# Altium schematic sheet AmpBreakout.SchDoc
size 431 x 279 mm; SheetNumber: 3; SheetTotal: 3
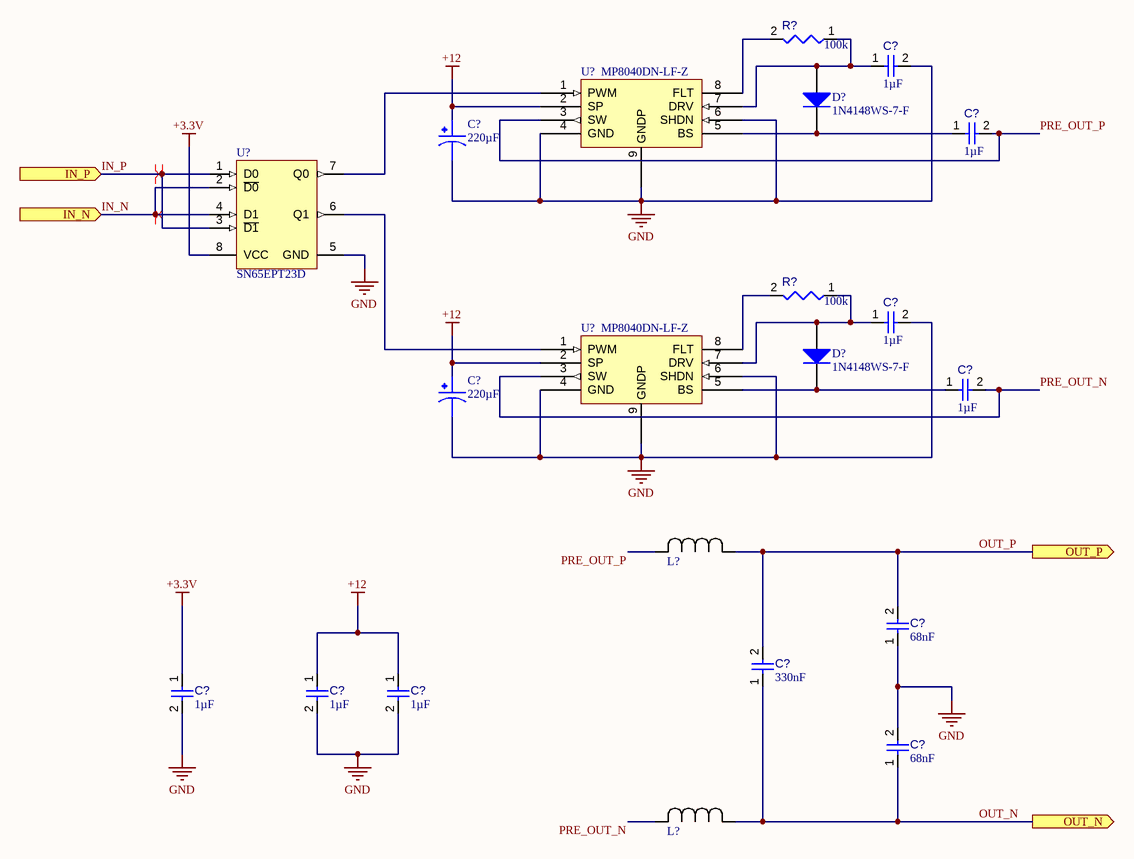
[diagram p0: AmpBreakout.SchDoc]

## Parts
(Parts that share a designator on the sheet are numbered #1, #2 ... from top to bottom, then left to right.)
C?#1  value 1µF  [CAPC2013X135X45NL10T25]  (hidden comment: Capacitor 1 uF +/- 10% 50 V 0805)
C?#2  value 1µF  [CAPC2013X135X45NL10T25]  (hidden comment: Capacitor 1 uF +/- 10% 50 V 0805)
C?#3  220µF  [CAPAE1030X1080N_UWT1H221MNL1GS]
C?#4  value 1µF  [CAPC2013X135X45NL10T25]  (hidden comment: Capacitor 1 uF +/- 10% 50 V 0805)
C?#5  value 1µF  [CAPC2013X135X45NL10T25]  (hidden comment: Capacitor 1 uF +/- 10% 50 V 0805)
C?#6  220µF  [CAPAE1030X1080N_UWT1H221MNL1GS]
C?#7  value 68nF  [FP-C0805C-DN-IPC_A]  (hidden comment: C0805C683K1RACTU)
C?#8  value 1µF  [CAPC2013X135X45NL10T25]  (hidden comment: Capacitor 1 uF +/- 10% 50 V 0805)
C?#9  value 1µF  [CAPC2013X135X45NL10T25]  (hidden comment: Capacitor 1 uF +/- 10% 50 V 0805)
C?#10  value 1µF  [CAPC2013X135X45NL10T25]  (hidden comment: Capacitor 1 uF +/- 10% 50 V 0805)
C?#11  value 330nF  [CAPC2012X14M]  (hidden comment: C2012X7R1H334K125AA)
C?#12  value 68nF  [FP-C0805C-DN-IPC_A]  (hidden comment: C0805C683K1RACTU)
D?#1  1N4148WS-7-F  [DIOD-SOD323-2-A_V]
D?#2  1N4148WS-7-F  [DIOD-SOD323-2-A_V]
L?#1  PQ2614BHA-220K  [IND_PQ2614_BRN]  (value not drawn)
L?#2  PQ2614BHA-220K  [IND_PQ2614_BRN]  (value not drawn)
R?#1  value 100k  [RESC0402(1005)_L]  (hidden comment: 100KR2F)
R?#2  value 100k  [RESC0402(1005)_L]  (hidden comment: 100KR2F)
U?#1  MP8040DN-LF-Z  [SOIC127P600X130_HS-9M]
U?#2  SN65EPT23D  [D0008A_L]
U?#3  MP8040DN-LF-Z  [SOIC127P600X130_HS-9M]

## Ports
IN_N (in), IN_P (in), OUT_N (out), OUT_P (out)

## Nets
+3.3V: C?#8.1 U?#2.8(VCC)
+12: C?#3.1 C?#6.1 C?#9.1 C?#10.1 U?#1.2(SP) U?#3.2(SP)
GND: C?#1.2 C?#3.2 C?#4.2 C?#6.2 C?#7.1 C?#8.2 C?#9.2 C?#10.2 C?#12.2 U?#1.4(GND) U?#1.6(SHDN) U?#1.9(GNDP) U?#2.5(GND) U?#3.4(GND) U?#3.6(SHDN) U?#3.9(GNDP)
IN_N: U?#2.2(~{D0}) U?#2.4(D1) ; port IN_N
IN_P: U?#2.1(D0) U?#2.3(~{D1}) ; port IN_P
OUT_N: C?#11.1 C?#12.1 L?#2.1 ; port OUT_N
OUT_P: C?#7.2 C?#11.2 L?#1.1 ; port OUT_P
PRE_OUT_N: C?#5.2 L?#2.2 U?#3.3(SW)
PRE_OUT_P: C?#2.2 L?#1.2 U?#1.3(SW)
NetC?#1_1: C?#1.1 D?#1.1(A) R?#1.1 U?#1.7(DRV)
NetC?#2_1: C?#2.1 D?#1.2(K) U?#1.5(BS)
NetC?#4_1: C?#4.1 D?#2.1(A) R?#2.1 U?#3.7(DRV)
NetC?#5_1: C?#5.1 D?#2.2(K) U?#3.5(BS)
NetR?#1_2: R?#1.2 U?#1.8(FLT)
NetR?#2_2: R?#2.2 U?#3.8(FLT)
NetU?#1_1: U?#1.1(PWM) U?#2.7(Q0)
NetU?#2_6: U?#2.6(Q1) U?#3.1(PWM)

## Layout directives
differential pair: IN_N, IN_P

## Notes on the sheet
- DWG. NO.
- REV.
- SHT.
- THIS DOCUMENT AND THE DATA DISCLOSED HEREIN OR HEREWITH IS THE PROPERTY OF ALTIUM LIMITED AND MAY BE FREELY DISTRIBUTED IN WHOLE. NO RIGHTS ARE RESERVED OR EXPRESS OR IMPLIED WARANTEE GIVEN.
- REVISION
- DESCRIPTION
- DATE
- APPROVED
- ENG:
- APPROVALS
- PROJECT
- DSN:
- CHK:
- REFERENCE DOCUMENTS
- PROJECT REVISION:
- TITLE
- DOCUMENT REVISION:
- DESIGN ITEM:
- BOM:
- FAB DWG:
- PCB DWG:
- ASSY DWG:
- SCALE:
- SIZE
- B
- CAGE CODE
- FILE NAME
- DWG NO.
- SHEET
- OF
- REV

## Library data of the parts
C?#1 C?#2 C?#4 C?#5 C?#8-C?#10 = CMP-001-00007-6: Chip Capacitor, 1 uF, +/- 10%, 50 V, 0805 (2012 Metric); Capacitor Type: Ceramic; Voltage Rating: 50V; Min Operating Temperature: -55°C; RoHS Compliant: True; Mounting Technology: SM; Case/Package: 0805; Max Operating Temperature: 125°C; Tolerance: 10%; Pins: 2
C?#3 C?#6 = CMP-017-000000-1: 220ÂµF 50V Aluminum Electrolytic Capacitors Radial, Can - SMD 1000 Hrs @ 105Â°C; MF: Nichicon; SnapEDA_Link: https://www.snapeda.com/parts/UWT1H221MNL1GS/Nichicon/view-part/566503/?ref=snap; Package: Radial Nichicon; Source: SnapEDAsch.SchLib; Price: None; Pin Count: 2; Value: *; Availability: Unavailable; MP: UWT1H221MNL1GS; Component Type: Standard; Design Item ID: UWT1H221MNL1GS
C?#7 C?#12 = CMP-001-00086-1: Ceramic Capacitor, Multilayer, Ceramic, 100V, 10% +Tol, 10% -Tol, X7R, 15% TC, 0.068uF, Surface Mount, 0805; Min Operating Temperature: -55°C; Mounting Technology: Surface Mount; Max Operating Temperature: 125°C; RoHS Compliant: Yes; Pins: 2; Capacitor Type: Ceramic; Case/Package: 0805
C?#11 = CMP-001-00084-2: Ceramic Capacitor, Multilayer, Ceramic, 50V, 10% +Tol, 10% -Tol, X7R, 15% TC, 0.33uF, Surface Mount, 0805; Pins: 2; RoHS Compliant: Yes; Min Operating Temperature: -55°C; Capacitor Type: Ceramic; Max Operating Temperature: 125°C; Case/Package: 0805; Mounting Technology: Surface Mount
D?#1 D?#2 = CMP-004-00002-2: Fast Switching Diode, 75 V, 0.3 A, -65 to 150 degC, 2-Pin SOD323, RoHS, Tape and Reel; Manufacturer: Diodes Inc; Peak Reverse Current: 1uA; Max Surge Current: 2A; Elements: 1; Forward Current: 300mA; Recovery Time: 4ns; Forward Voltage: 1.25V; Datasheet Version: Rev. 25-2, 03/2016; Case/Package: SOD; Min Operating Temperature: -65°C; RoHS Compliant: True; Max Operating Temperature: 150°C; Manufacturer URL: http://www.diodes.com/; Pins: 2; Package Quantity: 3000; Datasheet URL: http://www.diodes.com/datasheets/ds30097.pdf; Packaging: TapeandReel; Package Description: 2-Pin Small Outline Diode, Body 1.7 x 1.3 mm; Mounting Technology: SM; Package Reference: SOD323-2
L?#1 L?#2 = CMP-006-00021-1: No Description Available; Mfr_Name: Bourns Electronics; Type: Fixed Inductors; Design Item ID: PQ2614BHA-220K; Source: PQ2614BHA-220K.SchLib
R?#1 R?#2 = CMP-009-00064-2: 100K 0.063W 1% 0402 (1005 Metric)  SMD; Power: 63mW; Case/Package: 0402; Mounting Technology: SMT; Pins: 2; Tolerance: 1%
U?#1 U?#3 = CMP-00024-00006-1: Half Bridge Based Peripheral Driver, 9A, PDSO8; Nominal Supply Voltage: 12V; Built-in Protections: Over Current,Under Voltage,THERMAL; Case/Package: HLSOP; Pins: 8; Interface IC Type: HALF BRIDGE BASED PERIPHERAL DRIVER; Max Operating Temperature: 85°C; RoHS Compliant: Yes; JESD-30 Code: R-PDSO-G8; Min Operating Temperature: -40°C; Height - Seated (Max): 1.676mm
U?#2 = CMP-016-00010-1: Low Skew Clock Driver, 65EP Series, 2 True Output(s), 0 Inverted Output(s), ECL, PDSO8; Nominal Supply Voltage: 3.3V; Min Supply Voltage: 3V; Max Supply Voltage: 3.6V; Input Conditioning: DIFFERENTIAL; RoHS Compliant: Yes; Height - Seated (Max): 1.75mm; Logic Type: LOW SKEW CLOCK DRIVER; Max Operating Temperature: 85°C; JESD-30 Code: R-PDSO-G8; Min Operating Temperature: -40°C; Case/Package: SOP; JESD-609 Code: e4; Pins: 8